# EAGLE design W01 (EAGLE 9.6.2)
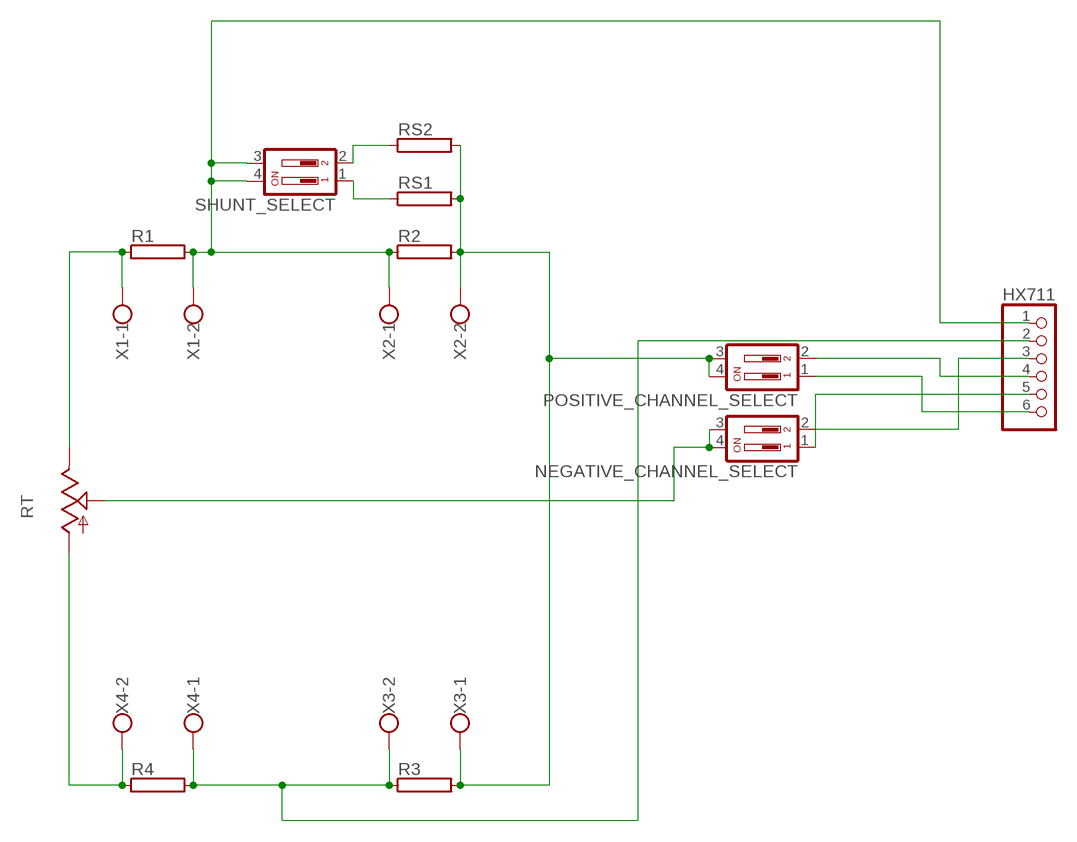
[diagram p0: schematic, sheet 1]

## Parts
HX711  PINHD-1X6  [1X06]
NEGATIVE_CHANNEL_SELECT  DIP02YL  [DIP02YL]
POSITIVE_CHANNEL_SELECT  DIP02YL  [DIP02YL]
R1  RAC03  [AC03]
R2  RAC03  [AC03]
R3  RAC03  [AC03]
R4  RAC03  [AC03]
RS1  RAC03  [AC03]
RS2  RAC03  [AC03]
RT  TRIM_US-RJ9W  [RJ9W]
SHUNT_SELECT  DIP02YL  [DIP02YL]
X1  W237-102  [W237-102]
X2  W237-102  [W237-102]
X3  W237-102  [W237-102]
X4  W237-102  [W237-102]

## Nets
N$1: HX711.1 R1.2 R2.1 SHUNT_SELECT.3 SHUNT_SELECT.4 X1.2 X2.1
N$2: RS2.1 SHUNT_SELECT.2
N$3: HX711.2 R3.1 R4.2 X3.2 X4.1
N$4: R1.1 RT.E X1.1
N$5: R4.1 RT.A X4.2
N$6: HX711.4 POSITIVE_CHANNEL_SELECT.2
N$7: HX711.6 POSITIVE_CHANNEL_SELECT.1
N$8: HX711.5 NEGATIVE_CHANNEL_SELECT.1
N$9: HX711.3 NEGATIVE_CHANNEL_SELECT.2
N$10: POSITIVE_CHANNEL_SELECT.3 POSITIVE_CHANNEL_SELECT.4 R2.2 R3.2 RS1.2 RS2.2 X2.2 X3.1
N$11: NEGATIVE_CHANNEL_SELECT.3 NEGATIVE_CHANNEL_SELECT.4 RT.S
N$12: RS1.1 SHUNT_SELECT.1

## Library data of the parts
HX711 = pinhead:PINHD-1X6: PIN HEADER
NEGATIVE_CHANNEL_SELECT POSITIVE_CHANNEL_SELECT SHUNT_SELECT = switch-dil:DIP02YL: DIL/CODE SWITCH; OC_FARNELL: unknown; OC_NEWARK: unknown
R1-R4 RS1 RS2 = resistor-power:R: Power Resitor; OC_FARNELL: unknown; OC_NEWARK: unknown
RT = pot:TRIM_US-: POTENTIOMETER
X1-X4 = con-wago-500:W237-102: WAGO SCREW CLAMP; MPN: 237-102; OC_FARNELL: unknown; OC_NEWARK: 70K9898

## Board
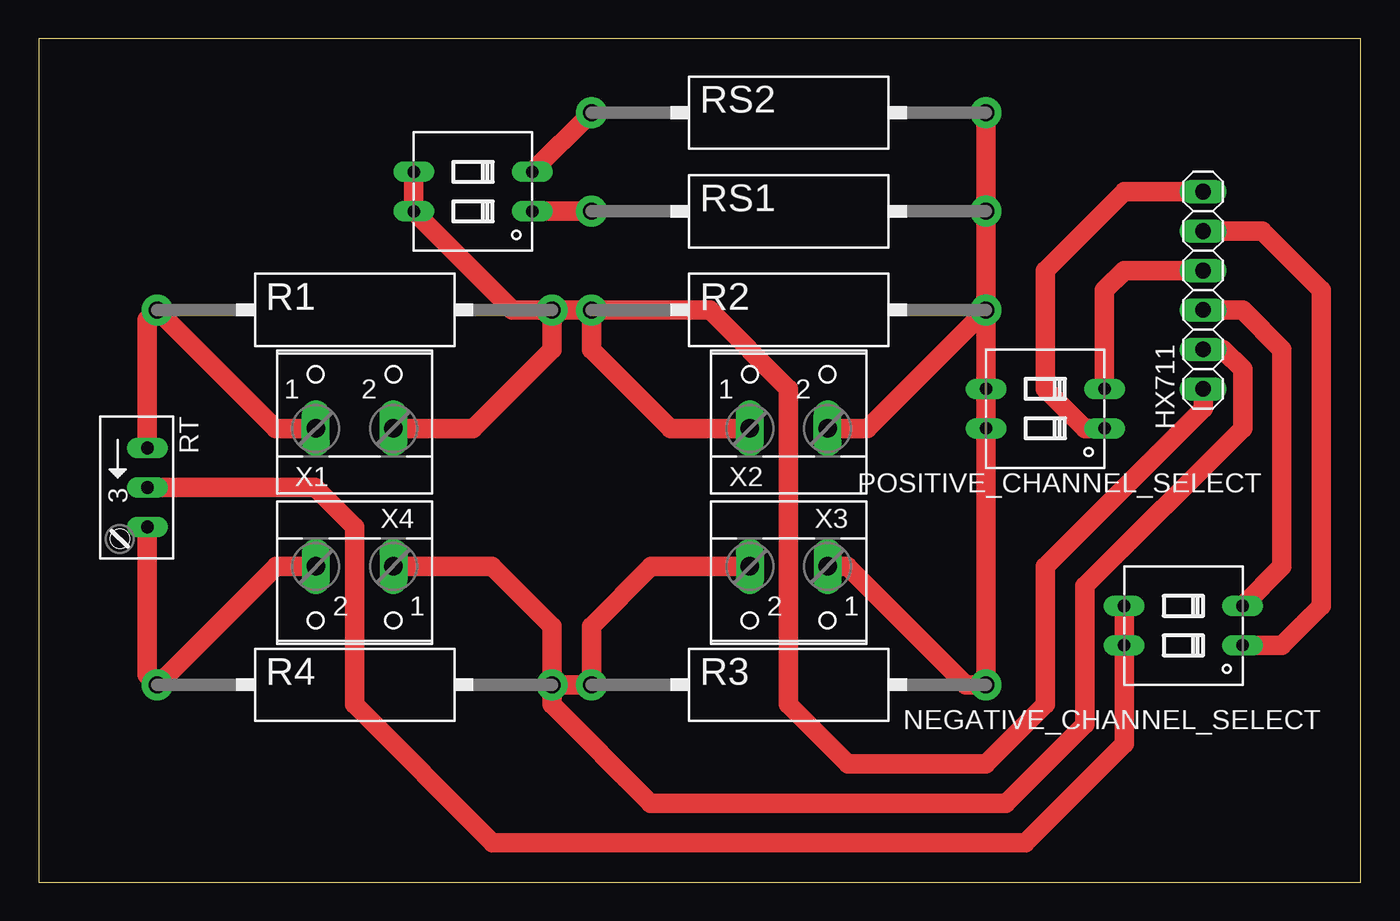
[diagram p1: board, top side]
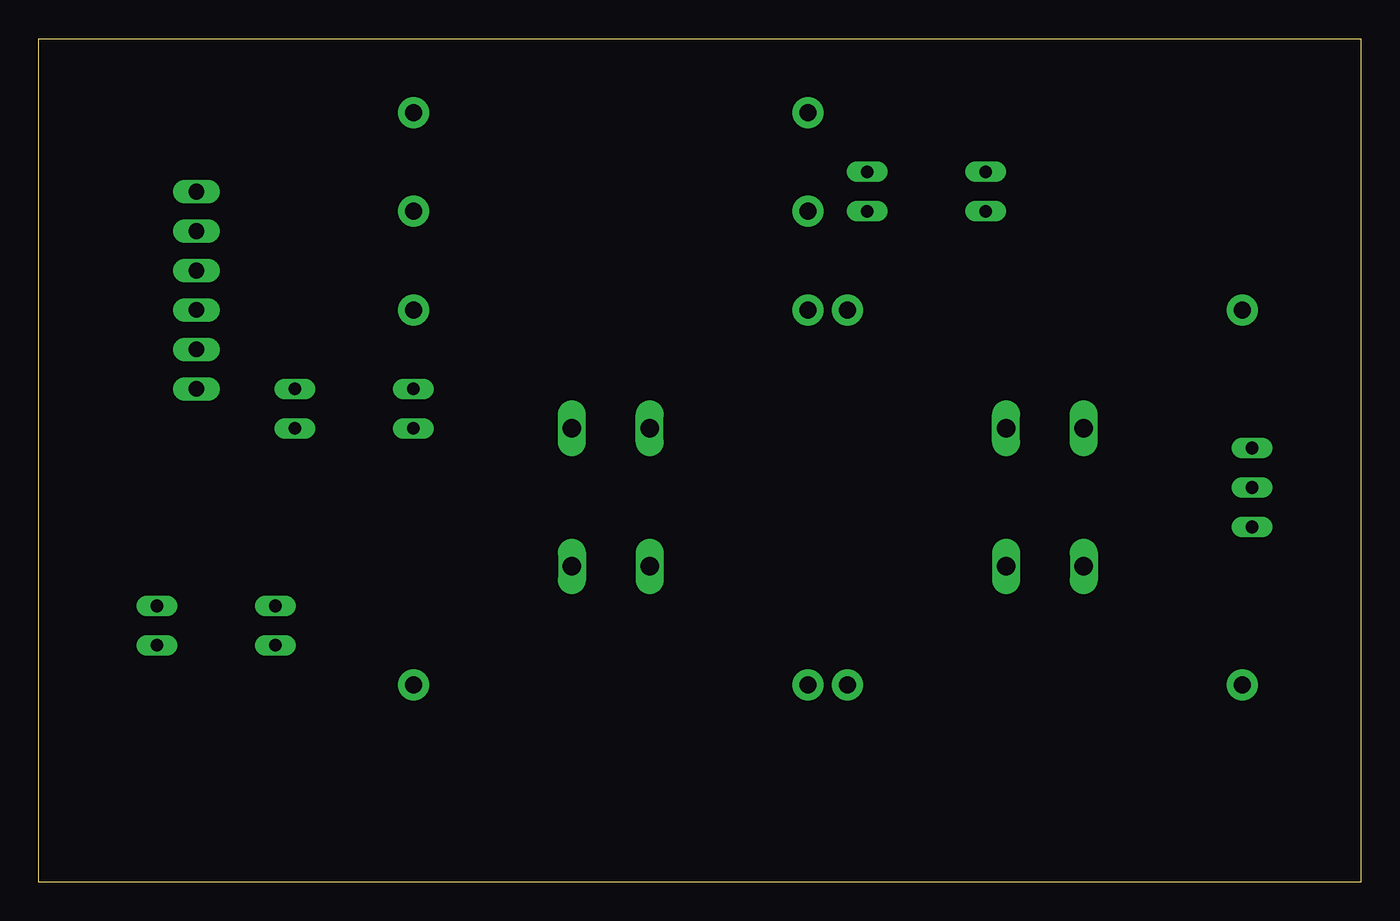
[diagram p2: board, bottom side, seen from below]

Size 85.07 x 54.28 mm. Coordinates in mm from the lower left corner, seen from the top.
Outline: 0,0 85.07,0 85.07,54.28 0,54.28 0,0
Copper layers (1*16): Top 0.035mm / dielectric 1.5mm / Bottom 0.035mm
Design rules "default": minimum track width 6mil, minimum drill 0.35mm, track to track 6mil, track to pad 6mil, pad to pad 6mil, via to via 6mil, smd to smd 6mil, copper to edge 40mil, drill to drill 6mil, minimum pad ring 10mil, minimum via ring 8mil, stop-mask expansion 4mil, vias tented up to drill 0mil, thermal gap 10mil

### Footprints (pad centres in the part's own frame; a part is rotated, then mirrored left to right if it is on the bottom)
1X06 = drill 1.016 long: 1 -6.35,0; 2 -3.81,0; 3 -1.27,0; 4 1.27,0; 5 3.81,0; 6 6.35,0
DIP02YL = drill 0.813 long: 1 -1.27,-3.81; 2 1.27,-3.81; 3 1.27,3.81; 4 -1.27,3.81
AC03 = drill 1.1 pad 2: 1 -12.7,0; 2 12.7,0
RJ9W = drill 0.813 long: A 2.54,0.635; E -2.54,0.635; S 0,0.635
W237-102 = drill 1.194 long: 1 -2.5,-1.27; 2 2.5,-1.27

### Placement (x,y rotation side)
HX711  74.93,38.1 90 top
NEGATIVE_CHANNEL_SELECT  73.66,16.51 90 top
POSITIVE_CHANNEL_SELECT  64.77,30.48 90 top
R1  20.32,36.83 0 top
R2  48.26,36.83 0 top
R3  48.26,12.7 0 top
R4  20.32,12.7 0 top
RS1  48.26,43.18 0 top
RS2  48.26,49.53 0 top
RT  6.35,25.4 270 top
SHUNT_SELECT  27.94,44.45 90 top
X1  20.32,30.48 0 top
X2  48.26,30.48 0 top
X3  48.26,19.05 180 top
X4  20.32,19.05 180 top

### Tracks (layer width: path | path; a pad name or v marks a point on that pad's centre or on a via)
N$1
  Top 1.27: R2.1 R1.2 | R1.2 33.02,34.29 27.94,29.21 X1.2 | X2.1 40.64,29.21 35.56,34.29 R2.1 | SHUNT_SELECT.3 SHUNT_SELECT.4 30.48,36.83 R1.2 | HX711.1 74.93,30.48 64.77,20.32 64.77,11.43 60.96,7.62 52.07,7.62 48.26,11.43 48.26,31.75 43.18,36.83 R2.1
N$2
  Top 1.27: RS2.1 SHUNT_SELECT.2
N$3
  Top 1.27: R4.2 R3.1 35.56,16.47 39.41,20.32 X3.2 | R4.2 33.02,16.47 29.17,20.32 X4.1 | R4.2 33.02,11.43 39.37,5.08 62.23,5.08 67.31,10.16 67.31,19.05 77.47,29.21 77.47,33.02 76.2,34.29 HX711.2
N$4
  Top 1.27: RT.E 6.99,36.2 R1.1 15.24,29.21 X1.1
N$5
  Top 1.27: RT.A 6.99,13.34 R4.1 7.66,12.7 15.28,20.32 X4.2
N$6
  Top 1.27: POSITIVE_CHANNEL_SELECT.2 68.58,38.1 69.85,39.37 HX711.4
N$7
  Top 1.27: HX711.6 69.85,44.45 64.77,39.37 64.77,31.75 67.31,29.21 POSITIVE_CHANNEL_SELECT.1
N$8
  Top 1.27: NEGATIVE_CHANNEL_SELECT.1 80.01,15.24 82.55,17.78 82.55,38.1 78.74,41.91 HX711.5
  Bottom 1.27: 78.13,15.24 NEGATIVE_CHANNEL_SELECT.1
N$9
  Top 1.27: HX711.3 77.47,36.83 80.01,34.29 80.01,20.32 NEGATIVE_CHANNEL_SELECT.2
N$10
  Top 1.27: POSITIVE_CHANNEL_SELECT.3 R3.2 59.65,12.7 52.03,20.32 X3.1 | POSITIVE_CHANNEL_SELECT.3 R2.2 | RS2.2 RS1.2 R2.2 | POSITIVE_CHANNEL_SELECT.4 POSITIVE_CHANNEL_SELECT.3 | X2.2 53.34,29.21 R2.2
N$11
  Top 1.27: NEGATIVE_CHANNEL_SELECT.3 NEGATIVE_CHANNEL_SELECT.4 69.85,8.89 63.5,2.54 29.21,2.54 20.32,11.43 20.32,22.86 17.78,25.4 RT.S
N$12
  Top 1.27: RS1.1 SHUNT_SELECT.1